# EAGLE design gvg-300-bus-3rows-usb-horiz-v1 (EAGLE 7.7.0)
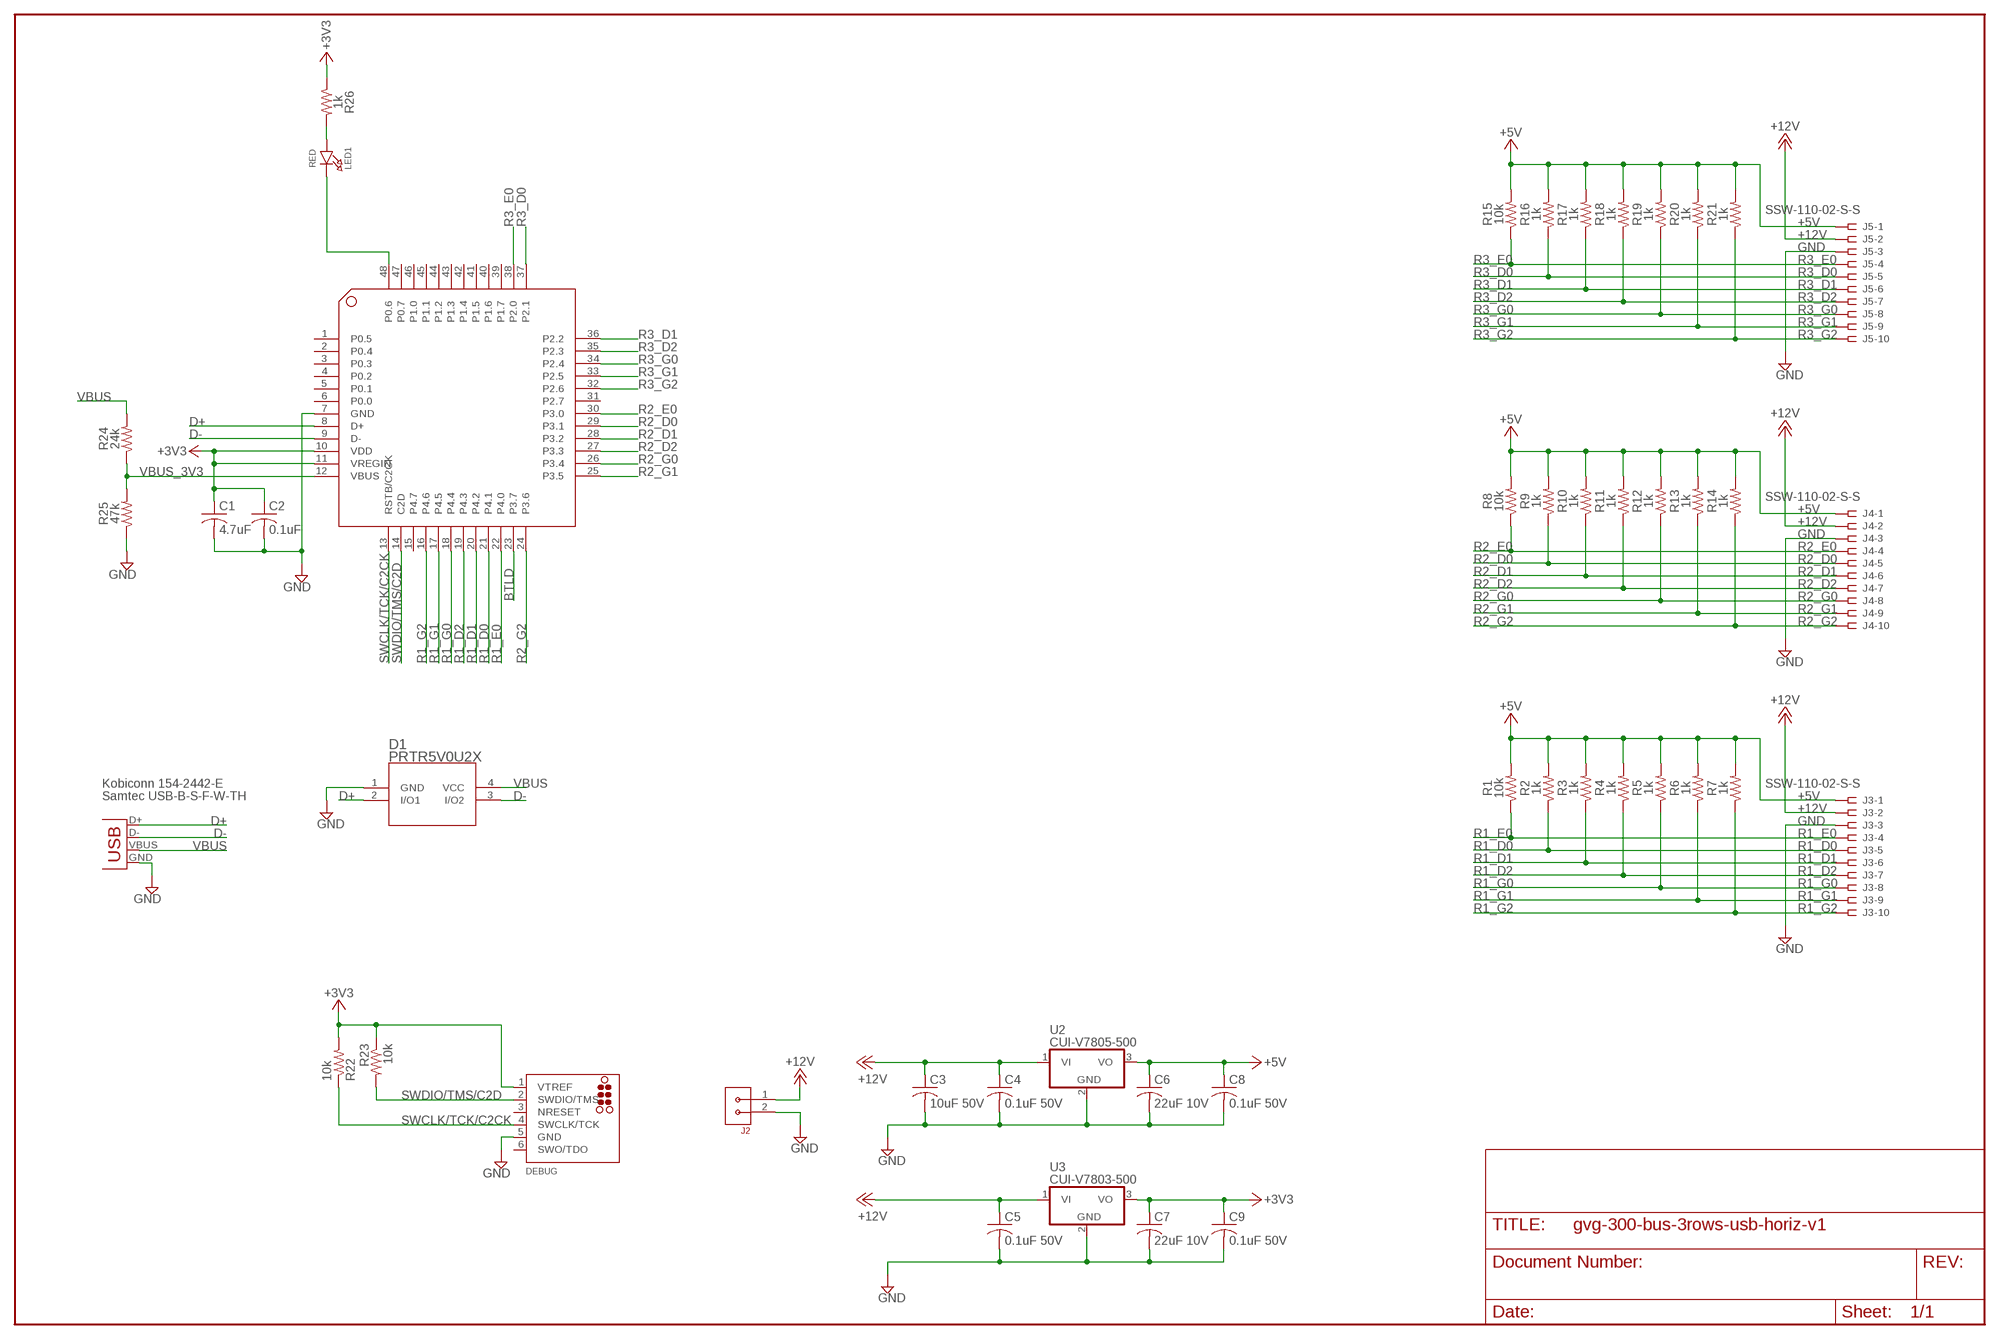
[diagram p0: schematic, sheet 1]

## Parts
C1  4.7uF  C-USC0805K  [C0805K]
C2  0.1uF  C-USC0603K  [C0603K]
C3  10uF 50V  C-USC1210K  [C1210K]
C4  0.1uF 50V  C-USC1206K  [C1206K]
C5  0.1uF 50V  C-USC1206K  [C1206K]
C6  22uF 10V  C-USC1206K  [C1206K]
C7  22uF 10V  C-USC1206K  [C1206K]
C8  0.1uF 50V  C-USC1206K  [C1206K]
C9  0.1uF 50V  C-USC1206K  [C1206K]
D1  PRTR5V0U2X  [SOT143B]
DEBUG  TC2030-CTX-SWD  [TC2030-MCP-NL]
J1  USB-B  USBPTH  [USB-B-PTH]
J2  CON-3.81MM-1X2-PHOENIX  [CON-PHOENIX-3.81-1X2-RA]
J3  SSW-110-02-S-S  [SSW-110-02-S-S]
J4  SSW-110-02-S-S  [SSW-110-02-S-S]
J5  SSW-110-02-S-S  [SSW-110-02-S-S]
LED1  RED  LED0805_NOOUTLINE  [CHIPLED_0805_NOOUTLINE]
R1  10k  R-US_R0603  [R0603]
R2  1k  R-US_R0603  [R0603]
R3  1k  R-US_R0603  [R0603]
R4  1k  R-US_R0603  [R0603]
R5  1k  R-US_R0603  [R0603]
R6  1k  R-US_R0603  [R0603]
R7  1k  R-US_R0603  [R0603]
R8  10k  R-US_R0603  [R0603]
R9  1k  R-US_R0603  [R0603]
R10  1k  R-US_R0603  [R0603]
R11  1k  R-US_R0603  [R0603]
R12  1k  R-US_R0603  [R0603]
R13  1k  R-US_R0603  [R0603]
R14  1k  R-US_R0603  [R0603]
R15  10k  R-US_R0603  [R0603]
R16  1k  R-US_R0603  [R0603]
R17  1k  R-US_R0603  [R0603]
R18  1k  R-US_R0603  [R0603]
R19  1k  R-US_R0603  [R0603]
R20  1k  R-US_R0603  [R0603]
R21  1k  R-US_R0603  [R0603]
R22  10k  R-US_R0603  [R0603]
R23  10k  R-US_R0603  [R0603]
R24  24k  R-US_R0603  [R0603]
R25  47k  R-US_R0603  [R0603]
R26  1k  R-US_R0603  [R0603]
U1  EFM8UB20F64G-B-QFP48  [EFM8UB2-QFP48]
U2  CUI-V7805-500  CUI-V7803-500  [CUI-78XX-500]
U3  CUI-V7803-500  [CUI-78XX-500]

## Nets
+3V3: C1.1 C2.1 C7.1 C9.1 DEBUG.1(VTREF) R22.2 R23.1 R26.1 U1.10(VDD) U1.11(VREGIN) U3.3(VO)
+5V: C6.1 C8.1 J3.1 J4.1 J5.1 R1.2 R2.2 R3.2 R4.2 R5.2 R6.2 R7.2 R8.2 R9.2 R10.2 R11.2 R12.2 R13.2 R14.2 R15.2 R16.2 R17.2 R18.2 R19.2 R20.2 R21.2 U2.3(VO)
+12V: C3.1 C4.1 C5.1 J2.1 J3.2 J4.2 J5.2 U2.1(VI) U3.1(VI)
BTLD: U1.23(P3.7)
D+: D1.2(I/O1) J1.D+ U1.8(D+)
D-: D1.3(I/O2) J1.D- U1.9(D-)
GND: C1.2 C2.2 C3.2 C4.2 C5.2 C6.2 C7.2 C8.2 C9.2 D1.1(GND) DEBUG.5(GND) J1.GND J2.2 J3.3 J4.3 J5.3 R25.1 U1.7(GND) U2.2(GND) U3.2(GND)
N$3: LED1.A R26.2
N$5: LED1.C U1.48(P0.6)
R1_D0: J3.5 R2.1 U1.21(P4.1)
R1_D1: J3.6 R3.1 U1.20(P4.2)
R1_D2: J3.7 R4.1 U1.19(P4.3)
R1_E0: J3.4 R1.1 U1.22(P4.0)
R1_G0: J3.8 R5.1 U1.18(P4.4)
R1_G1: J3.9 R6.1 U1.17(P4.5)
R1_G2: J3.10 R7.1 U1.16(P4.6)
R2_D0: J4.5 R9.1 U1.29(P3.1)
R2_D1: J4.6 R10.1 U1.28(P3.2)
R2_D2: J4.7 R11.1 U1.27(P3.3)
R2_E0: J4.4 R8.1 U1.30(P3.0)
R2_G0: J4.8 R12.1 U1.26(P3.4)
R2_G1: J4.9 R13.1 U1.25(P3.5)
R2_G2: J4.10 R14.1 U1.24(P3.6)
R3_D0: J5.5 R16.1 U1.37(P2.1)
R3_D1: J5.6 R17.1 U1.36(P2.2)
R3_D2: J5.7 R18.1 U1.35(P2.3)
R3_E0: J5.4 R15.1 U1.38(P2.0)
R3_G0: J5.8 R19.1 U1.34(P2.4)
R3_G1: J5.9 R20.1 U1.33(P2.5)
R3_G2: J5.10 R21.1 U1.32(P2.6)
SWCLK/TCK/C2CK: DEBUG.4(SWCLK/TCK) R22.1 U1.13(RSTB/C2CK)
SWDIO/TMS/C2D: DEBUG.2(SWDIO/TMS) R23.2 U1.14(C2D)
VBUS: D1.4(VCC) J1.VBUS R24.2
VBUS_3V3: R24.1 R25.2 U1.12(VBUS)
Unconnected: DEBUG.6(SWO/TDO) U1.1(P0.5) U1.2(P0.4) U1.3(P0.3) U1.4(P0.2) U1.5(P0.1) U1.6(P0.0) U1.15(P4.7) U1.31(P2.7) U1.39(P1.7) U1.40(P1.6) U1.41(P1.5) U1.42(P1.4) U1.43(P1.3) U1.44(P1.2) U1.45(P1.1) U1.46(P1.0) U1.47(P0.7)

## Notes on the sheet
- Kobiconn 154-2442-E
- Samtec USB-B-S-F-W-TH

## Power pins joined to a net without a drawn wire
NRESET: DEBUG.3(NRESET)

## Library data of the parts
C1 C2 = rcl:C-US: CAPACITOR, American symbol
C3 = rcl:C-US: CAPACITOR, American symbol; MFR: KEMET; MFR_PART_NO: C1210C106K5RACTU
C4 C5 C8 C9 = rcl:C-US: CAPACITOR, American symbol; MFR: KEMET; MFR_PART_NO: C1206S104M5RACTU
C6 C7 = rcl:C-US: CAPACITOR, American symbol; MFR: KEMET; MFR_PART_NO: C1206C226K8RAC7800
D1 = Nexperia_PRTR5V0U2X,215:PRTR5V0U2X; MANUFACTURER_PART_NUMBER: PRTR5V0U2X; VENDOR: NXP
DEBUG = tag-connect:TC2030-CTX-SWD
J1 = SparkFun-Connectors:USB: USB Connectors USB-B-PTH is fully proven SKU : PRT-00139/CONN-08278 USB-miniB is fully proven SKU : PRT-00587 USB-A-PCB is untested. USB-A-H is throughly reviewed, but untested. Spark Fun Electronics SKU : PRT-00437 USB-B-SMT is throughly reviewed, but untested. Needs silkscreen touching up. USB-A-S has not been used/tested USB-MB-H has not been used/tested USB-MICROB has been used. CONN-09505; MFR: KOBICONN; MFR_PART_NO: 154-2442-E; PROD_ID: CONN-08278
J2 = 0GlenConnectors:CON-3.81MM-1X2-PHOENIX
J3-J5 = con-samtec:SSW-110-02-S-S: THROUGH-HOLE .025" SQ POST SOCKET Source: Samtec SSW.pdf; MPN: SSW-110-02-S-S; OC_FARNELL: unknown; OC_NEWARK: 11P9482
LED1 = microbuilder:LED: LED 0603 - 0603 Surface Mount Package 2mA: Green LED - Low Power (3.9mcd, 2ma, 1.7Vf) - Digikey: 475-2709-2-ND Orange LED - Low Power (9.8mcd, 2ma, 1.8Vf) - Digikey: 475-1194-2-ND Red LED - Low Power (5mcd, 2ma, 1.8Vf) - Digikey: 475-1195-2-ND Yellow LED - Low Power (7mcd, 2ma, 1.8Vf) - Digikey: 475-1196-2-ND 5mA: Blue LED - Low Power (17mcd, 5ma, 2.9Vf) - Digikey: LNJ937W8CRACT-ND 0805 - 0805 Surface Mount Package 2mA: Red LED (8.8mcd, 2mA, 1.8Vf, Clear) - Low Power [Digikey: 475-2510-1-ND] Green LED (5mcd, 2mA, 1.8Vf, Clear) - Low Power [Digikey: 475-2730-1-ND] Yellow LED (11.3mcd, 2mA, 1.8Vf, Clear) - Low Power [Digikey: 475-2555-1-ND] 20mA: Red LED (104mcd, 20mA, Diffused) - LS R976 [Digikey: 475-1278-6-ND] Red LED (12mcd, 20mA, 2.0Vf, Clear) - APT2012EC [Digikey: 754-1128-1-ND] Green LED (15mcd, 20mA, 2.2Vf, Clear) - APT2012GC [Digikey: 754-1131-1-ND] Orange LED (160mcd, 20mA, 2.1Vf, Clear) - APT2012SECK [Digikey: 754-1130-1-ND] 1206 - 1206 Surface Mount Package Green LED (26mcd, 20mA, Diffused) - LG N971 [Digikey: 475-1407-6-ND] Red LED (15mcd, 20mA, Diffused) - LH N974 [Digikey: 475-1416-6-ND] Cree - Cree High-Power Surface Mount LEDs XPEBWT-L1-0000-00D50 - White 111lm 350mA 2.9Vf 6200K 110° XTEAWT-00-0000-00000LEE3 - White 114lm 350mA 2.85Vf 5000K 115° Everlight - Everlight 45-21 Series Surface Mount LEDs 45-21/QK2C-B2832AC2CB2/2T - Warm White 2000mcd 20mA 3.25Vf 3050K 120° 45-21/LK2C-B38452C4CB2/2T - Nuetral White 2000mcd 20mA 3.25Vf 4150K 120° 45-21/LK2C-B50634C6CB2/2T - Cold White 2200mcd 20mA 3.25Vf 5650K 120° PLCC2 Reverse Mount LS T77K-J1L2-1-0-2-R18-Z - Red 11.25mcd 2mA 1.8Vf 630nm 120° LO T77K-L1M2-24-Z - Orange 19.6mcd 2mA 1.8Vf 606nm 120° LY T77K-K2M1-26-Z - Yellow 15.7mcd 2mA 1.8Vf 587nm 120°
R1-R26 = rcl:R-US_: RESISTOR, American symbol
U1 = Glen-EFM8UB2:EFM8UB20F64G-B-QFP48
U2 U3 = GlenPartsLibrary:CUI-V7803-500

## Board
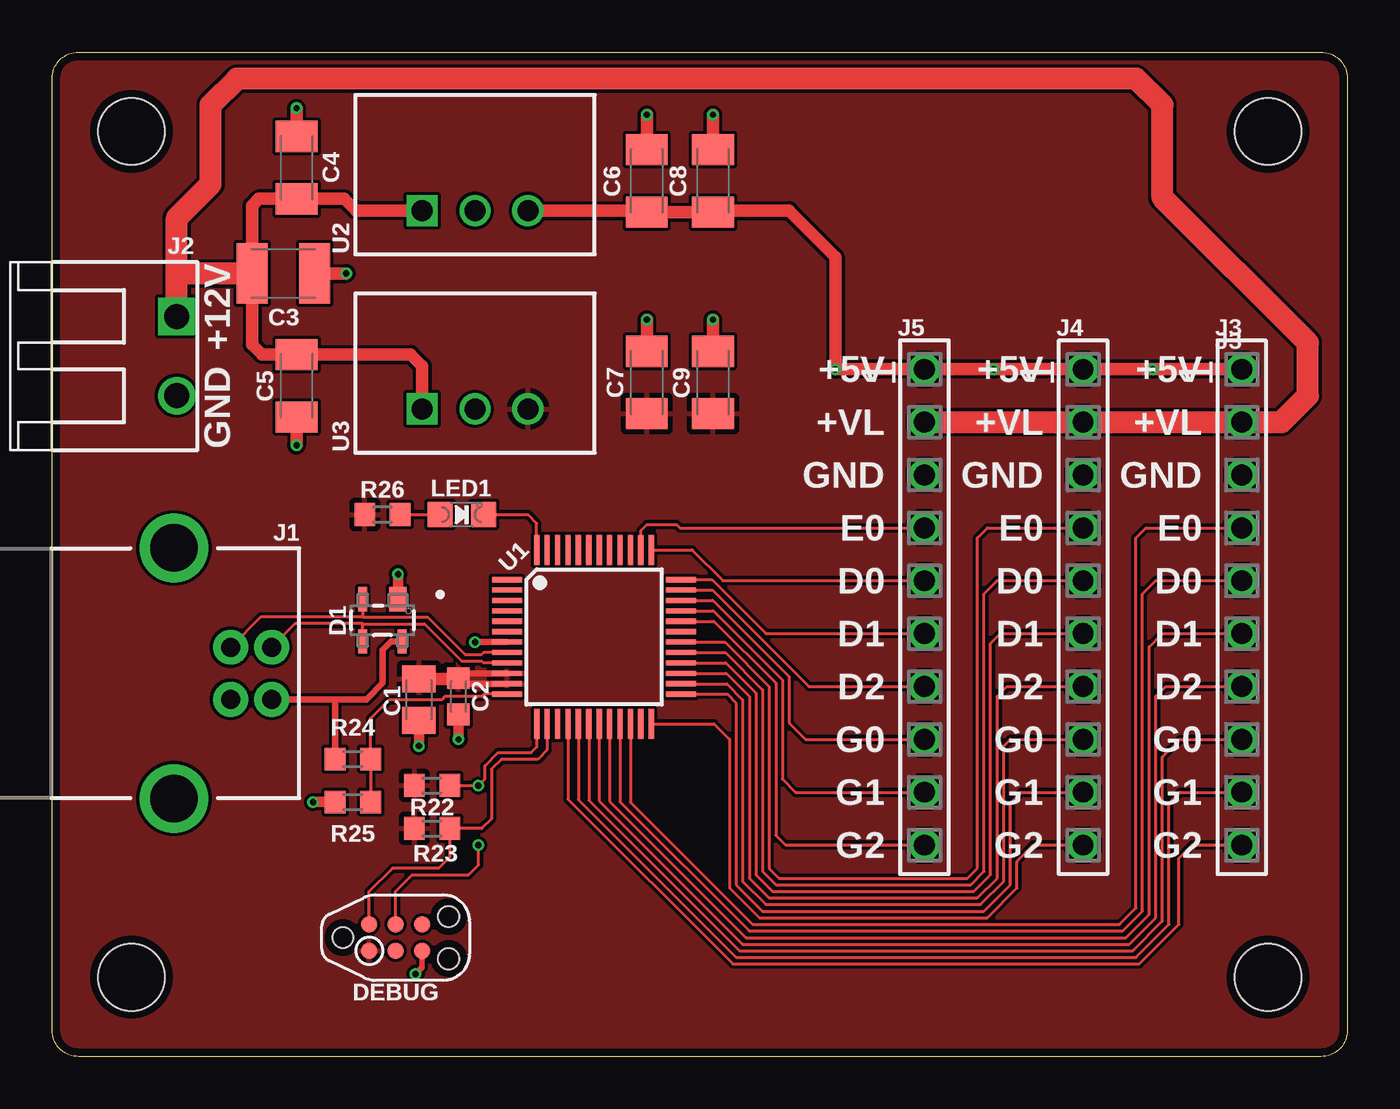
[diagram p1: board, top side]
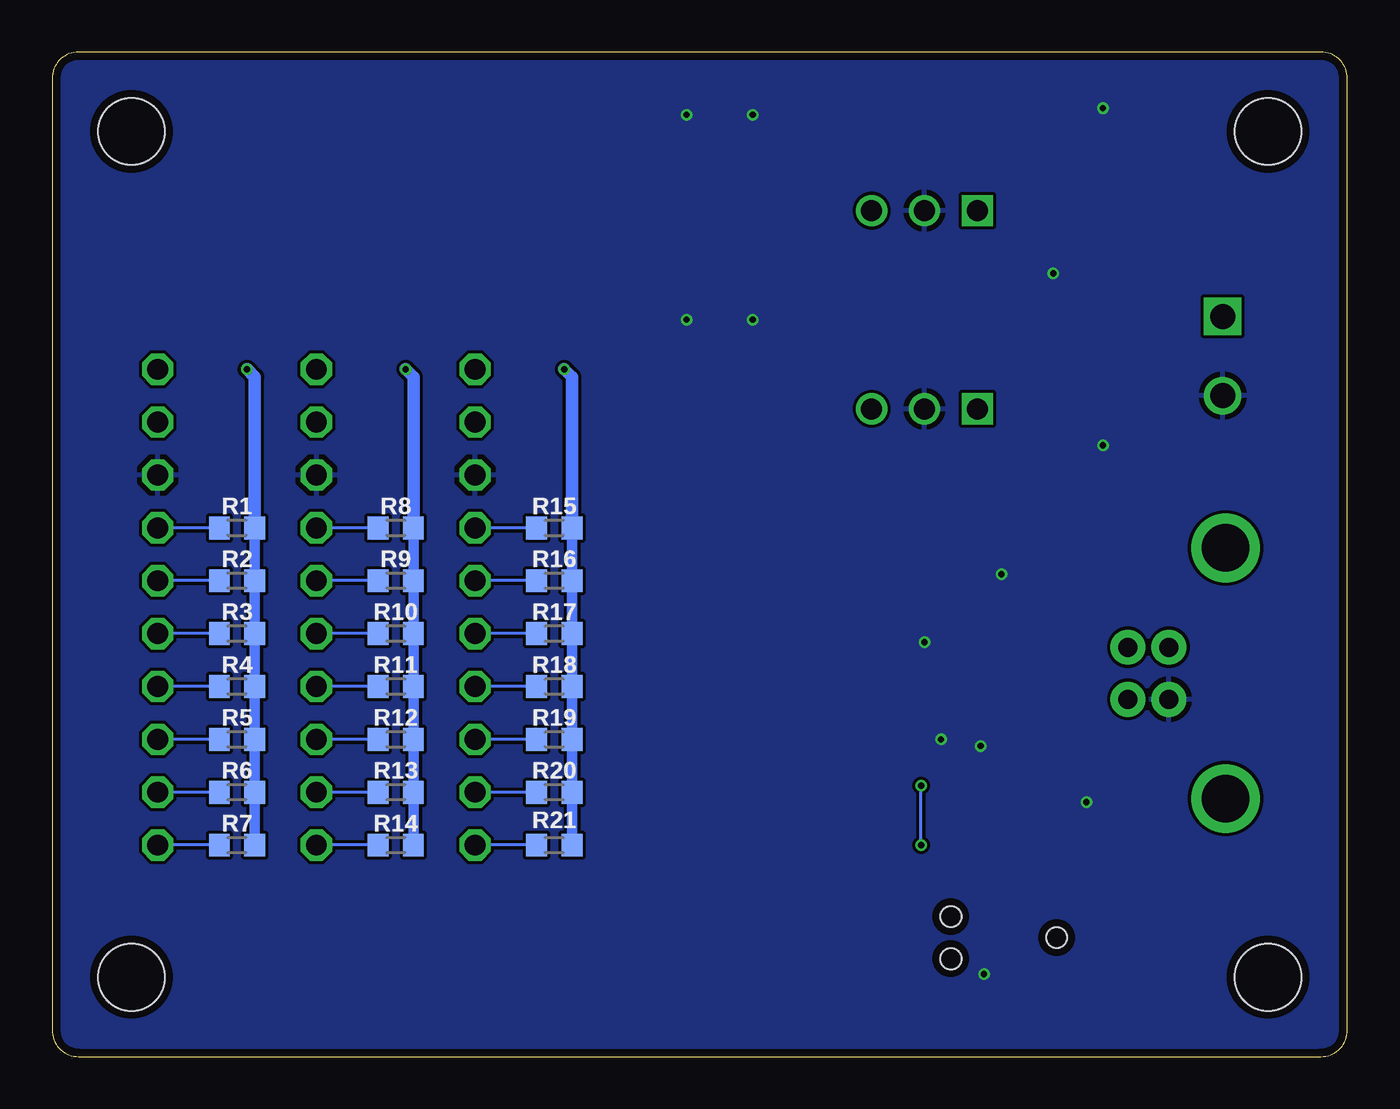
[diagram p2: board, bottom side, seen from below]

Size 62.23 x 48.26 mm. Coordinates in mm from the lower left corner, seen from the top.
Outline: 60.96,48.26 arc-90 62.23,46.99 62.23,1.27 arc-90 60.96,0 1.27,0 arc-90 0,1.27 0,46.99 arc-90 1.27,48.26 60.96,48.26
Copper layers (1*16): Top 0.035559375mm / dielectric 1.6mm / Bottom 0.035559375mm
Design rules "oshpark-2layer-2018": minimum track width 6mil, minimum drill 10mil, track to track 6mil, track to pad 6mil, pad to pad 6mil, via to via 6mil, smd to smd 6mil, copper to edge 15mil, drill to drill 6mil, minimum pad ring 5mil, minimum via ring 5mil, stop-mask expansion 2.5mil, vias tented up to drill 0mil, thermal gap 10mil
Holes 3.2 mm at 58.42,44.45 58.42,3.81 3.81,3.81 3.81,44.45
tKeepout: 8 lines

### Footprints (pad centres in the part's own frame; a part is rotated, then mirrored left to right if it is on the bottom)
C0805K = smd 1.3 x 1.6: 1 -1,0; 2 1,0
C0603K = smd 1.05 x 1.08: 1 -0.875,0; 2 0.875,0
C1210K = smd 1.5 x 2.9: 1 -1.5,0; 2 1.5,0
C1206K = smd 1.5 x 2: 1 -1.5,0; 2 1.5,0
SOT143B = smd 0.838 x 1.168: 1 -0.747,-1.016 | smd 0.432 x 1.168: 2 0.95,-1.016; 3 0.95,1.016; 4 -0.95,1.016
TC2030-MCP-NL = smd 0.787 x 0.787: 1 1.27,-0.635; 2 1.27,0.635; 3 2.54,-0.635; 4 2.54,0.635; 5 3.81,-0.635; 6 3.81,0.635 | hole 0.991: 0,0; 5.08,-1.016; 5.08,1.016
USB-B-PTH = drill 0.914 pad 1.676: D+ 0,1.25; D- 1.981,1.25; GND 0,-1.25; VBUS 1.981,-1.25 | drill 2.286: S1 -2.718,-6.02; S2 -2.718,6.02
CON-PHOENIX-3.81-1X2-RA = drill 1.2 square: 1 0,0 | drill 1.2: 2 3.81,0
SSW-110-02-S-S = drill 1 pad 1.5 octagon: 1 -11.43,0; 2 -8.89,0; 3 -6.35,0; 4 -3.81,0; 5 -1.27,0; 6 1.27,0; 7 3.81,0; 8 6.35,0; 9 8.89,0; 10 11.43,0
CHIPLED_0805_NOOUTLINE = smd 1.2 x 1.2: A 0,-1.05; C 0,1.05
R0603 = smd 1 x 1.1: 1 -0.85,0; 2 0.85,0
EFM8UB2-QFP48 = smd 1.45 x 0.25: 1 -4.175,2.75; 2 -4.175,2.25; 3 -4.175,1.75; 4 -4.175,1.25; 5 -4.175,0.75; 6 -4.175,0.25; 7 -4.175,-0.25; 8 -4.175,-0.75; 9 -4.175,-1.25; 10 -4.175,-1.75; 11 -4.175,-2.25; 12 -4.175,-2.75; 25 4.175,-2.75; 26 4.175,-2.25; 27 4.175,-1.75; 28 4.175,-1.25; 29 4.175,-0.75; 30 4.175,-0.25; 31 4.175,0.25; 32 4.175,0.75; 33 4.175,1.25; 34 4.175,1.75; 35 4.175,2.25; 36 4.175,2.75 | smd 0.25 x 1.45: 13 -2.75,-4.175; 14 -2.25,-4.175; 15 -1.75,-4.175; 16 -1.25,-4.175; 17 -0.75,-4.175; 18 -0.25,-4.175; 19 0.25,-4.175; 20 0.75,-4.175; 21 1.25,-4.175; 22 1.75,-4.175; 23 2.25,-4.175; 24 2.75,-4.175; 37 2.75,4.175; 38 2.25,4.175; 39 1.75,4.175; 40 1.25,4.175; 41 0.75,4.175; 42 0.25,4.175; 43 -0.25,4.175; 44 -0.75,4.175; 45 -1.25,4.175; 46 -1.75,4.175; 47 -2.25,4.175; 48 -2.75,4.175
CUI-78XX-500 = drill 1 square: 1 0,0 | drill 1: 2 2.54,0; 3 5.08,0

### Placement (x,y rotation side)
C1  17.62,17.14 270 top
C2  19.53,17.3 270 top
C3  11.11,37.62 0 top
C4  11.75,42.7 90 top
C5  11.75,32.23 270 top
C6  28.57,42.07 90 top
C7  28.57,32.38 90 top
C8  31.75,42.07 90 top
C9  31.75,32.38 90 top
D1  15.88,20.95 180 top
DEBUG  13.97,5.71 0 top
J1  8.57,18.41 0 top
J2  5.99,35.56 270 top
J3  57.15,21.59 270 top
J4  49.53,21.59 270 top
J5  41.91,21.59 270 top
LED1  19.68,26.04 270 top
R1  53.34,25.4 0 bottom
R2  53.34,22.86 0 bottom
R3  53.34,20.32 0 bottom
R4  53.34,17.78 0 bottom
R5  53.34,15.24 0 bottom
R6  53.34,12.7 0 bottom
R7  53.34,10.16 0 bottom
R8  45.72,25.4 0 bottom
R9  45.72,22.86 0 bottom
R10  45.72,20.32 0 bottom
R11  45.72,17.78 0 bottom
R12  45.72,15.24 0 bottom
R13  45.72,12.7 0 bottom
R14  45.72,10.16 0 bottom
R15  38.1,25.4 0 bottom
R16  38.1,22.86 0 bottom
R17  38.1,20.32 0 bottom
R18  38.1,17.78 0 bottom
R19  38.1,15.24 0 bottom
R20  38.1,12.7 0 bottom
R21  38.1,10.16 0 bottom
R22  18.26,13.02 180 top
R23  18.26,10.95 0 top
R24  14.45,14.29 180 top
R25  14.45,12.22 0 top
R26  15.88,26.04 0 top
U1  26.04,20.16 0 top
U2  17.78,40.64 0 top
U3  17.78,31.11 0 top

### Tracks (layer width: path | path; a pad name or v marks a point on that pad's centre or on a via)
+3V3
  Top 0.305: U1.10 19.76,18.41 C2.1 | U1.11 19.79,17.91 C2.1 | 19.49,18.14 C2.1
  Top 0.61: C1.1 19.48,18.14 19.53,18.1
  pour Top (isolate 0.152): 0,48.26 0,0 62.23,0 62.23,48.26
+5V  (via drill 0.3)
  Top 0.61: U2.3 28.5,40.64 C6.1 C8.1 31.82,40.64 35.4,40.64 37.62,38.42 v37.62,33.02 J5.1 v45.24,33.02 J4.1 v52.86,33.02 J3.1
  Bottom 0.508: R8.2 R9.2 R10.2 R11.2 R12.2 R13.2 R14.2 | R15.2 R16.2 R17.2 R18.2 R19.2 R20.2 R21.2 | R1.2 R2.2 R3.2 R4.2 R5.2 R6.2 R7.2
  Bottom 0.61: R15.2 37.25,32.65 v37.62,33.02 | R8.2 44.87,32.65 v45.24,33.02 | R1.2 52.49,32.65 v52.86,33.02
+12V
  Top 0.61: U2.1 14.61,40.64 14.04,41.2 C4.1 9.93,41.2 9.61,40.89 C3.1 9.61,34.2 10.09,33.73 C5.1 17.23,33.73 17.78,33.18 U3.1
  Top 1.067: J2.1 5.99,37.62 | 5.99,37.62 5.99,40.28 7.62,41.91 7.62,45.72 8.89,46.99 52.07,46.99 53.34,45.72 53.34,41.27 60.33,34.29 60.33,31.75 59.05,30.48 J3.2 J4.2 J5.2 | C3.1 5.99,37.62
D+
  Top 0.152: 14.92,21.11 14.93,21.27 D1.2 14.93,21.12 | U1.8 20.73,19.41 20.64,19.33 19.84,19.33 18.05,21.12 14.93,21.12 | 14.92,21.11 14.93,21.12 | 14.92,21.11 10.02,21.11 J1.D+
D-
  Top 0.152: 14.92,20.8 14.93,20.64 D1.3 14.93,20.79 | 14.93,20.79 14.92,20.8 | U1.9 20.73,18.91 20.64,19 19.68,19 17.89,20.79 14.93,20.79 | 14.92,20.8 11.69,20.8 J1.D-
GND  (via drill 0.3)
  Top 0.254: DEBUG.5 17.78,4.29 v17.46,3.97
  Top 0.305: U1.7 v20.32,19.91
  Top 0.508: R25.1 v12.54,12.22 | C2.2 v19.53,15.24 | C1.2 v17.62,14.92 | D1.1 v16.62,23.18
  Top 0.61: C4.2 v11.75,45.56 | C5.2 v11.75,29.37 | C6.2 v28.57,45.24 | C8.2 v31.75,45.24 | C7.2 v28.57,35.4 | C9.2 v31.75,35.4 | C3.2 v14.13,37.62
  pour Bottom (isolate 0.152): 0,48.26 0,0 62.23,0 62.23,48.26
N$3
  Top 0.152: R26.2 LED1.A
N$5
  Top 0.152: LED1.C 22.86,26.04 23.29,25.61 U1.48
R1_D0
  Top 0.152: J3.5 53.02,22.86 52.39,22.23 52.39,6.99 51.44,6.03 33.5,6.03 27.29,12.24 U1.21
  Bottom 0.152: R2.1 J3.5
R1_D1
  Top 0.152: U1.20 26.79,12.27 33.34,5.71 51.59,5.71 52.7,6.83 52.7,19.68 53.34,20.32 J3.6
  Bottom 0.152: R3.1 J3.6
R1_D2
  Top 0.152: U1.19 26.29,12.29 33.18,5.4 51.75,5.4 53.02,6.67 53.02,17.3 53.5,17.78 J3.7
  Bottom 0.152: R4.1 J3.7
R1_E0
  Top 0.152: U1.22 27.79,12.22 33.66,6.35 51.28,6.35 52.07,7.14 52.07,24.92 52.55,25.4 J3.4
  Bottom 0.152: J3.4 R1.1 53.98,25.4
R1_G0
  Top 0.152: U1.18 25.79,12.31 33.02,5.08 51.91,5.08 53.34,6.51 53.34,14.39 R5.1 J3.8
  Bottom 0.152: R5.1 J3.8
R1_G1
  Top 0.152: U1.17 25.29,12.34 32.86,4.76 52.07,4.76 53.66,6.35 53.66,12.17 R6.1 J3.9
  Bottom 0.152: R6.1 J3.9
R1_G2
  Top 0.152: U1.16 24.79,12.36 32.7,4.45 52.23,4.45 54.13,6.35 54.13,9.53 54.77,10.16 J3.10
  Bottom 0.152: R7.1 J3.10
R2_D0
  Top 0.152: U1.29 32.34,19.41 34.13,17.62 34.13,8.89 34.77,8.26 44.13,8.26 44.77,8.89 44.77,22.23 45.4,22.86 J4.5
  Bottom 0.152: R9.1 J4.5
R2_D1
  Top 0.152: U1.28 32.37,18.91 33.81,17.46 33.81,8.73 34.61,7.94 44.29,7.94 45.09,8.73 45.09,19.84 45.56,20.32 J4.6
  Bottom 0.152: R10.1 J4.6
R2_D2
  Top 0.152: U1.27 32.39,18.41 33.5,17.3 33.5,8.57 34.45,7.62 44.45,7.62 45.4,8.57 45.4,17.3 45.88,17.78 J4.7
  Bottom 0.152: R11.1 J4.7
R2_E0
  Top 0.152: U1.30 32.32,19.91 34.45,17.78 34.45,9.05 34.92,8.57 43.97,8.57 44.45,9.05 44.45,24.92 44.93,25.4 J4.4
  Bottom 0.152: R8.1 J4.4
R2_G0
  Top 0.152: U1.26 32.41,17.91 33.18,17.14 33.18,8.41 34.29,7.3 44.61,7.3 45.72,8.41 45.72,14.92 46.04,15.24 J4.8
  Bottom 0.152: R12.1 J4.8
R2_G1
  Top 0.152: U1.25 32.44,17.41 32.86,16.99 32.86,8.26 34.13,6.99 44.77,6.99 46.04,8.26 46.04,12.17 R13.1 J4.9
  Bottom 0.152: R13.1 J4.9
R2_G2
  Top 0.152: U1.24 31.8,15.99 32.54,15.24 32.54,8.1 33.97,6.67 44.93,6.67 46.35,8.1 46.35,9.37 47.15,10.16 J4.10
  Bottom 0.152: R14.1 J4.10
R3_D0
  Top 0.152: U1.37 30.75,24.34 32.23,22.86 J5.5
  Bottom 0.152: R16.1 J5.5
R3_D1
  Top 0.152: U1.36 31.7,22.91 34.29,20.32 J5.6
  Bottom 0.152: R17.1 J5.6
R3_D2
  Top 0.152: U1.35 31.72,22.41 36.35,17.78 J5.7
  Bottom 0.152: R18.1 J5.7
R3_E0
  Top 0.152: U1.38 28.29,25.27 28.57,25.56 30,25.56 30.16,25.4 J5.4
  Bottom 0.152: R15.1 J5.4
R3_G0
  Top 0.152: J5.8 36.2,15.24 35.4,16.03 35.4,18.26 31.75,21.91 U1.34
  Bottom 0.152: R19.1 J5.8
R3_G1
  Top 0.152: U1.33 31.77,21.41 35.08,18.1 35.08,13.34 35.72,12.7 J5.9
  Bottom 0.152: R20.1 J5.9
R3_G2
  Top 0.152: U1.32 31.79,20.91 34.77,17.94 34.77,10.64 35.24,10.16 J5.10
  Bottom 0.152: R21.1 J5.10
SWCLK/TCK/C2CK  (via drill 0.3)
  Top 0.152: R22.1 v20.48,13.02 20.8,13.34 20.8,13.97 21.43,14.61 23.02,14.61 23.29,14.87 U1.13 | DEBUG.4 16.51,7.94 17.3,8.73 20,8.73 20.48,9.21 v20.48,10.16
  Bottom 0.152: v20.48,10.16 v20.48,13.02
SWDIO/TMS/C2D
  Top 0.152: U1.14 23.79,14.74 23.34,14.29 21.59,14.29 21.11,13.81 21.11,11.43 20.64,10.95 R23.2 19.11,9.58 18.57,9.05 16.35,9.05 15.24,7.94 DEBUG.2
VBUS
  Top 0.152: 13.6,17.11 13.65,17.16
  Top 0.305: J1.VBUS 13.65,17.16 15.1,17.16 15.88,17.94 15.88,19.53 16.29,19.94 D1.4 | R24.2 13.6,17.11
VBUS_3V3
  Top 0.152: R25.2 R24.1 15.3,16.25 16.19,17.14 18.73,17.14 18.89,17.3 20.64,17.3 20.75,17.41 U1.12

### Text on the board
_tsilk: C4 | C6 | C8 | J2 | U2 | +12V | C3 | J5 | J4 | J3 | +5V | +5V | +5V | C5 | C7 | C9 | +VL | +VL | +VL | GND | U3 | GND | GND | GND | R26 | LED1 | J1 | E0 | E0 | E0 | U1 | D0 | D0 | D0 | D1 | D1 | D1 | D1 | D2 | D2 | D2 | C1 | C2 | R24 | G0 | G0 | G0 | G1 | G1 | G1 | R22 | R25 | R23 | G2 | G2 | G2 | DEBUG
_bsilk: R15 | R8 | R1 | R16 | R9 | R2 | R17 | R10 | R3 | R18 | R11 | R4 | R19 | R12 | R5 | R20 | R13 | R6 | R21 | R14 | R7